# Altium project ArduinoRelayTimer.PrjPcb
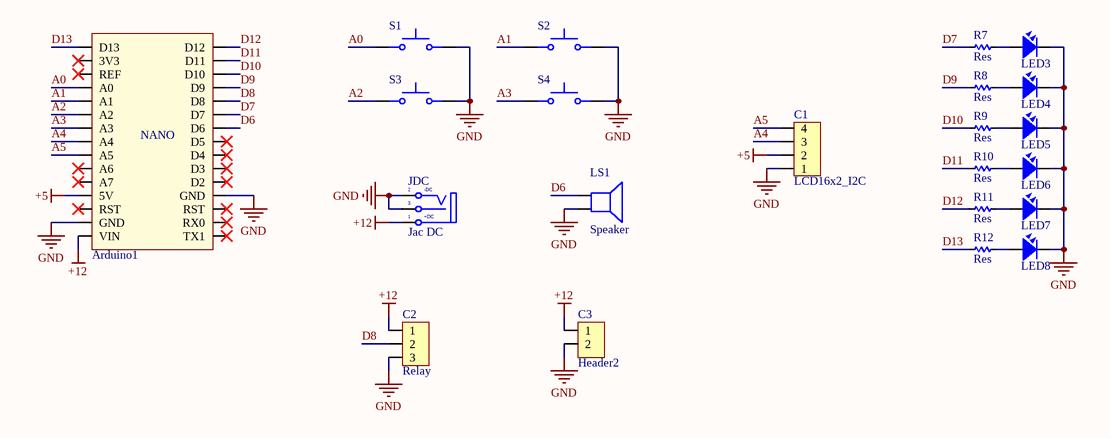
[diagram p0: ArduinoRelayTimerSche.SchDoc]
1 sheet, 22 parts. Net scope: global (net labels, ports and power ports of the same name join across sheets).
Board file: ArduinoRelayTimerPCB.PcbDoc

## Sheet ArduinoRelayTimerSche.SchDoc
size A4; SheetNumber: 1; SheetTotal: 1

### Parts
Arduino1  Arduino Nano  [Arduino Nano]  (value not drawn)
C1  LCD16x2_I2C  [Header4]
C2  Relay  [Header3]
C3  Header2  [Header2]
JDC  Jac DC  [DC0]
LED3  LED  [LED-5-Yellow]  (value not drawn)
LED4  LED  [LED-5-Yellow]  (value not drawn)
LED5  LED  [LED-5-Yellow]  (value not drawn)
LED6  LED  [LED-5-Yellow]  (value not drawn)
LED7  LED  [LED-5-Yellow]  (value not drawn)
LED8  LED  [LED-5-Yellow]  (value not drawn)
LS1  Speaker  [SPEAKER]
R7  Res  [RES-1/4W-SMALL]
R8  Res  [RES-1/4W-SMALL]
R9  Res  [RES-1/4W-SMALL]
R10  Res  [RES-1/4W-SMALL]
R11  Res  [RES-1/4W-SMALL]
R12  Res  [RES-1/4W-SMALL]
S1  (no value)  [SW_TL59NF160Q]
S2  (no value)  [SW_TL59NF160Q]
S3  (no value)  [SW_TL59NF160Q]
S4  (no value)  [SW_TL59NF160Q]

### Nets
+5: Arduino1.5V C1.2
+12: Arduino1.VIN C2.1 C3.1 JDC.1(T)
GND: Arduino1.GND C1.1 C2.3 C3.2 JDC.2(TN) JDC.3(S) LED3.2 LED4.2 LED5.2 LED6.2 LED7.2 LED8.2 LS1.2 S1.2 S2.2 S3.2 S4.2
A0: Arduino1.A0 S1.1
A1: Arduino1.A1 S2.1
A2: Arduino1.A2 S3.1
A3: Arduino1.A3 S4.1
A4: Arduino1.A4 C1.3
A5: Arduino1.A5 C1.4
D6: Arduino1.D6 LS1.1
D7: Arduino1.D7 R7.1
D8: Arduino1.D8 C2.2
D9: Arduino1.D9 R8.1
D10: Arduino1.D10 R9.1
D11: Arduino1.D11 R10.1
D12: Arduino1.D12 R11.1
D13: Arduino1.D13 R12.1
NetLED3_1: LED3.1 R7.2
NetLED4_1: LED4.1 R8.2
NetLED5_1: LED5.1 R9.2
NetLED6_1: LED6.1 R10.2
NetLED7_1: LED7.1 R11.2
NetLED8_1: LED8.1 R12.2

Not connected (* = marked no-connect by the designer): Arduino1 3V3* A6* A7* D2* D3* D4* D5* REF* RST* RX0* TX1*

### Notes on the sheet
- (in symbol Arduino Nano) NANO
- (in symbol DCIN) -DC; +DC

### Library data of the parts
Arduino1 = Arduino Nano: Value: Cau 1A
C1 = Header4: Header IDC, 4 x 1 Pin Vertical 2.54mm Pitch (Non-Boxed, Male); Manufacturer: W¨¹rth Elektronik eiSos GmbH; partNo: 613002143121; ComponentLink1 Description: Manufacturer; ComponentLink2 Description: Datasheet; NoPins: 02; Created Date: 29 March 2013; ComponentLink1URL: http://www.we-online.com; ComponentLink2URL: http://katalog.we-online.de/em/datasheet/6130xx143121.pdf; Created by: Karrer Zheng
C2 = Header3: Header IDC, 3 x 1 Pin Vertical 2.54mm Pitch (Non-Boxed, Male); Manufacturer: W¨¹rth Elektronik eiSos GmbH; partNo: 613002143121; ComponentLink1 Description: Manufacturer; ComponentLink2 Description: Datasheet; NoPins: 02; Created Date: 29 March 2013; ComponentLink1URL: http://www.we-online.com; ComponentLink2URL: http://katalog.we-online.de/em/datasheet/6130xx143121.pdf; Created by: Karrer Zheng
C3 = Header2: Header IDC, 2 x 1 Pin Vertical 2.54mm Pitch (Non-Boxed, Male); Manufacturer: W¨¹rth Elektronik eiSos GmbH; partNo: 613002143121; ComponentLink1 Description: Manufacturer; ComponentLink2 Description: Datasheet; NoPins: 02; Created Date: 29 March 2013; ComponentLink1URL: http://www.we-online.com; ComponentLink2URL: http://katalog.we-online.de/em/datasheet/6130xx143121.pdf; Created by: Karrer Zheng
JDC = DCIN: Jac DC input; Value: Jac DC
LED3-LED8 = LED: LED Single colour Green and Red; Value: LED 3 ly Single Colour
LS1 = Speaker: Loudspeaker; Published: 24-Mar-1999; LatestRevisionDate: 17-Jul-2002; LatestRevisionNote: Re-released for DXP Platform.; PackageReference: PIN2; Publisher: Altium Limited
R7-R12 = Res: Manufacturer: Generic Components; Class: Passive; SubClass: R; Published: 08/06/2000; Publisher: Altium Hobart Technology Centre
S1-S4 = TL59NF160Q: SWITCH TACTILE SPST-NO 0.05A 12V; MF: E-Switch; Purchase-URL: https://pricing.snapeda.com/search/part/TL59NF160Q/?ref=eda; Package: None; Value: *; SnapEDA_Link: https://www.snapeda.com/parts/TL59NF160Q/E-Switch/view-part/?ref=snap; Check_prices: https://www.snapeda.com/parts/TL59NF160Q/E-Switch/view-part/?ref=eda; Price: None; MP: TL59NF160Q; Availability: In Stock